# EAGLE board ECU_JUMPER (EAGLE 9.1.3), part 1 of 2
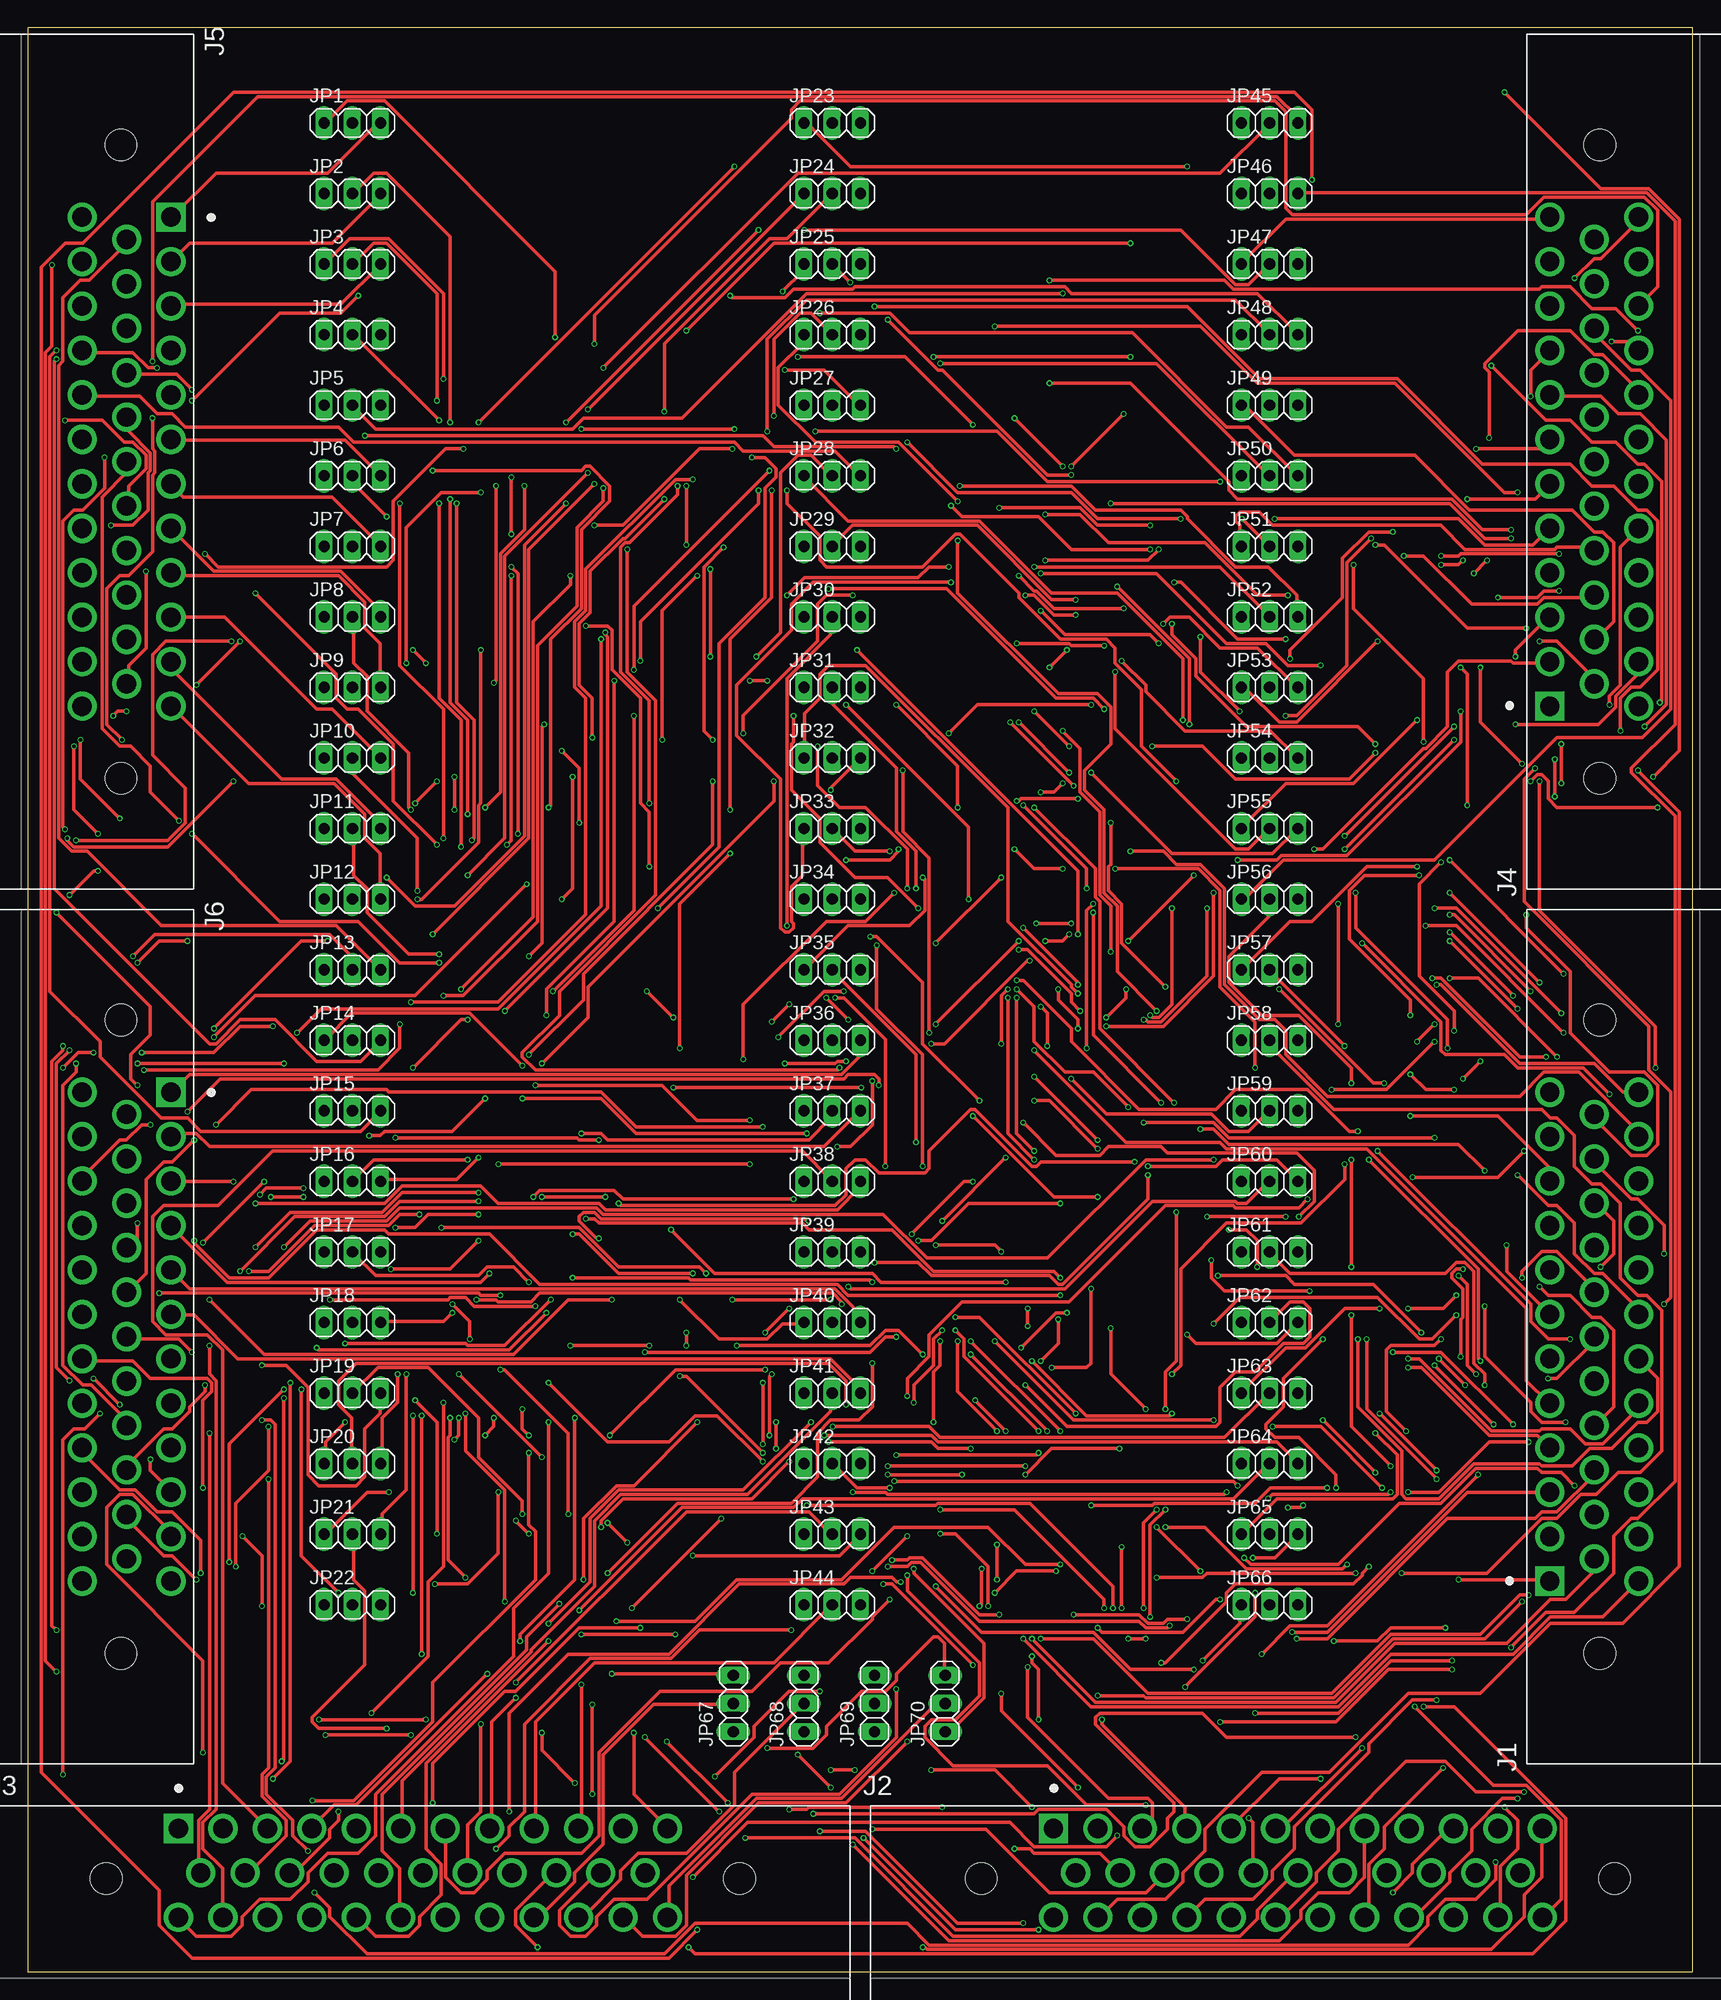
[diagram p2: board, top side]
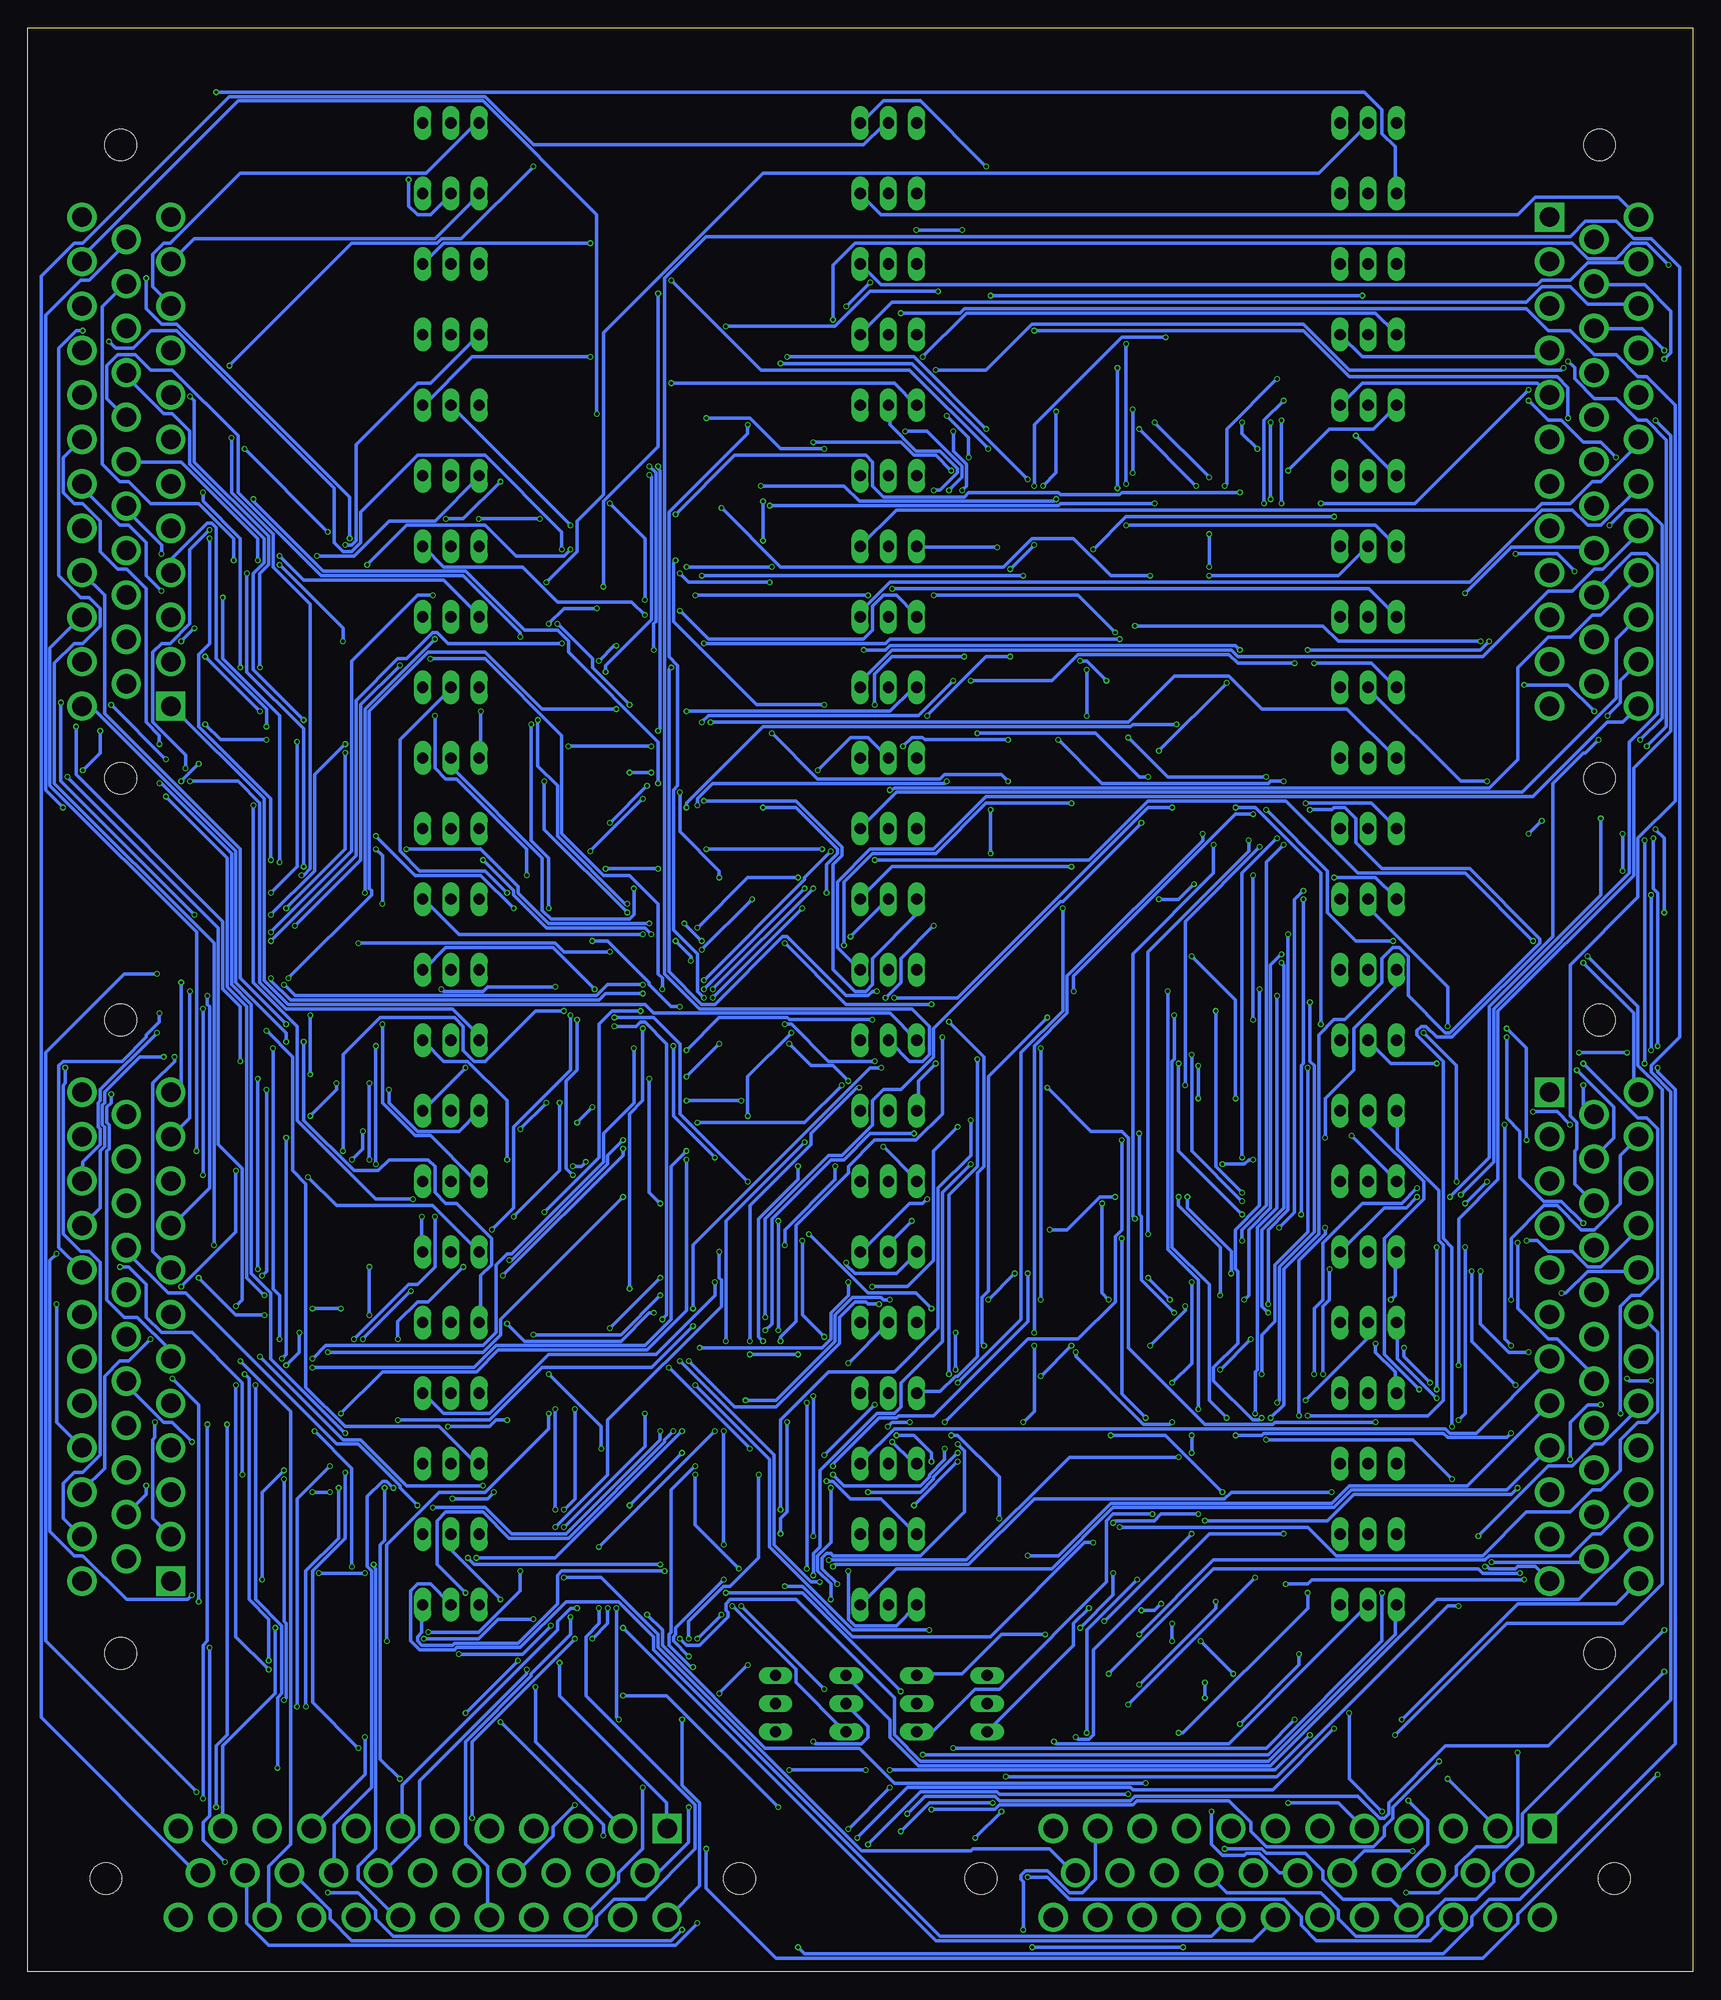
[diagram p3: board, bottom side, seen from below]

Size 149.84 x 174.93 mm. Coordinates in mm from the lower left corner, seen from the top.
Outline: 0,0 149.84,0 149.84,174.93 0,174.93 0,0
Copper layers (1*16): Top 0.035mm / dielectric 1.5mm / Bottom 0.035mm
Design rules "default *": minimum track width 12mil, minimum drill 0.3mm, track to track 3.5mil, track to pad 6mil, pad to pad 6mil, via to via 6mil, smd to smd 6mil, copper to edge 40mil, drill to drill 6mil, minimum pad ring 4mil, minimum via ring 4mil, stop-mask expansion 4mil, vias tented up to drill 0mil, thermal gap 10mil

## Footprints (pad centres in the part's own frame; a part is rotated, then mirrored left to right if it is on the bottom)
TE_776180-1 = drill 1.75 square: 1 -22,4 | drill 1.75: 2 -18,4; 3 -14,4; 4 -10,4; 5 -6,4; 6 -2,4; 7 2,4; 8 6,4; 9 10,4; 10 14,4; 11 18,4; 12 22,4; 13 -20,0; 14 -16,0; 15 -12,0; 16 -8,0; 17 -4,0; 18 0,0; 19 4,0; 20 8,0; 21 12,0; 22 16,0; 23 20,0; 24 -22,-4; 25 -18,-4; 26 -14,-4; 27 -10,-4; 28 -6,-4; 29 -2,-4; 30 2,-4; 31 6,-4; 32 10,-4; 33 14,-4; 34 18,-4; 35 22,-4 | hole 2.85: -28.5,-0.5; 28.5,-0.5
1X03 = drill 1.016 long: 1 -2.54,0; 2 0,0; 3 2.54,0

## Placement (x,y rotation side)
J1  776180-1  [TE_776180-1]  140.97,57.15 90 top
J2  776180-1  [TE_776180-1]  114.3,8.89 0 top
J3  776180-1  [TE_776180-1]  35.56,8.89 0 top
J4  776180-1  [TE_776180-1]  140.97,135.89 90 top
J5  776180-1  [TE_776180-1]  8.89,135.89 270 top
J6  776180-1  [TE_776180-1]  8.89,57.15 270 top
JP1  [1X03]  29.21,166.37 0 top
JP2  [1X03]  29.21,160.02 0 top
JP3  [1X03]  29.21,153.67 0 top
JP4  [1X03]  29.21,147.32 0 top
JP5  [1X03]  29.21,140.97 0 top
JP6  [1X03]  29.21,134.62 0 top
JP7  [1X03]  29.21,128.27 0 top
JP8  [1X03]  29.21,121.92 0 top
JP9  [1X03]  29.21,115.57 0 top
JP10  [1X03]  29.21,109.22 0 top
JP11  [1X03]  29.21,102.87 0 top
JP12  [1X03]  29.21,96.52 0 top
JP13  [1X03]  29.21,90.17 0 top
JP14  [1X03]  29.21,83.82 0 top
JP15  [1X03]  29.21,77.47 0 top
JP16  [1X03]  29.21,71.12 0 top
JP17  [1X03]  29.21,64.77 0 top
JP18  [1X03]  29.21,58.42 0 top
JP19  [1X03]  29.21,52.07 0 top
JP20  [1X03]  29.21,45.72 0 top
JP21  [1X03]  29.21,39.37 0 top
JP22  [1X03]  29.21,33.02 0 top
JP23  [1X03]  72.39,166.37 0 top
JP24  [1X03]  72.39,160.02 0 top
JP25  [1X03]  72.39,153.67 0 top
JP26  [1X03]  72.39,147.32 0 top
JP27  [1X03]  72.39,140.97 0 top
JP28  [1X03]  72.39,134.62 0 top
JP29  [1X03]  72.39,128.27 0 top
JP30  [1X03]  72.39,121.92 0 top
JP31  [1X03]  72.39,115.57 0 top
JP32  [1X03]  72.39,109.22 0 top
JP33  [1X03]  72.39,102.87 0 top
JP34  [1X03]  72.39,96.52 0 top
JP35  [1X03]  72.39,90.17 0 top
JP36  [1X03]  72.39,83.82 0 top
JP37  [1X03]  72.39,77.47 0 top
JP38  [1X03]  72.39,71.12 0 top
JP39  [1X03]  72.39,64.77 0 top
JP40  [1X03]  72.39,58.42 0 top
JP41  [1X03]  72.39,52.07 0 top
JP42  [1X03]  72.39,45.72 0 top
JP43  [1X03]  72.39,39.37 0 top
JP44  [1X03]  72.39,33.02 0 top
JP45  [1X03]  111.76,166.37 0 top
JP46  [1X03]  111.76,160.02 0 top
JP47  [1X03]  111.76,153.67 0 top
JP48  [1X03]  111.76,147.32 0 top
JP49  [1X03]  111.76,140.97 0 top
JP50  [1X03]  111.76,134.62 0 top
JP51  [1X03]  111.76,128.27 0 top
JP52  [1X03]  111.76,121.92 0 top
JP53  [1X03]  111.76,115.57 0 top
JP54  [1X03]  111.76,109.22 0 top
JP55  [1X03]  111.76,102.87 0 top
JP56  [1X03]  111.76,96.52 0 top
JP57  [1X03]  111.76,90.17 0 top
JP58  [1X03]  111.76,83.82 0 top
JP59  [1X03]  111.76,77.47 0 top
JP60  [1X03]  111.76,71.12 0 top
JP61  [1X03]  111.76,64.77 0 top
JP62  [1X03]  111.76,58.42 0 top
JP63  [1X03]  111.76,52.07 0 top
JP64  [1X03]  111.76,45.72 0 top
JP65  [1X03]  111.76,39.37 0 top
JP66  [1X03]  111.76,33.02 0 top
JP67  [1X03]  63.5,24.13 90 top
JP68  [1X03]  69.85,24.13 90 top
JP69  [1X03]  76.2,24.13 90 top
JP70  [1X03]  82.55,24.13 90 top

## Tracks (layer width: path | path; a pad name or v marks a point on that pad's centre or on a via)
1  (via drill 0.3)
  Top 0.305: v103.16,125.04 103.75,125.04 108.87,119.92 v113.2,119.92 | v119.5,97.09 119.5,93.94 127.77,85.67 v127.77,83.11 | v127.18,56.93 126.59,56.34 122.65,56.34 122.26,55.94 122.26,50.43 v124.03,48.66 | v120.68,36.45 120.09,35.87 120.09,35.67 119.3,34.88 108.67,34.88 107.89,34.09 107.89,33.31 102.38,27.79 v101.98,27.79
  Bottom 0.305: v103.16,125.04 100.41,127.79 100.41,130.55 98.04,132.91 98.04,147.48 83.67,161.85 33.67,161.85 29.34,166.18 JP1.2 | v113.2,119.92 119.5,113.62 v119.5,97.09 | v127.77,83.11 127.77,61.45 127.18,60.86 v127.18,56.93 | v124.03,48.66 120.68,45.31 v120.68,36.45 | v101.98,27.79 101.98,24.84 92.34,15.2 92.34,13.03 J2.1
1_1  (via drill 0.3)
  Top 0.305: v47.45,147.09 47.45,152.99 32.1,168.34 28.75,168.34 26.78,166.38 JP1.1 | v59.27,128.38 v59.27,133.7 | v61.43,118.34 v61.43,126.22 | v68.91,113.03 68.91,110.67 68.71,110.47 68.71,106.34 71.27,103.78 71.27,101.61 74.42,98.46 77.38,98.46 v80.13,95.71 | v88.2,87.64 88.2,75.43 v90.56,73.07 | v126.78,45.12 v121.67,50.23 | v128.75,35.27 136.82,35.27 J1.1
  Bottom 0.305: v47.45,147.09 51.39,147.09 59.27,139.21 v59.27,133.7 | v61.43,126.22 v59.27,128.38 | v61.43,118.34 63.59,118.34 v68.91,113.03 | v88.2,87.64 v80.13,95.71 | v90.56,73.07 90.56,59.49 94.11,55.94 107.49,55.94 109.46,53.97 117.93,53.97 v121.67,50.23 | v126.78,45.12 128.75,43.15 v128.75,35.27
1_2
  Top 0.305: JP1.3 31.71,166.18 31.31,166.18 26.98,161.85 16.94,161.85 13,157.91 J5.1
2  (via drill 0.3)
  Top 0.305: v38,139.41 38,156.14 32.3,161.85 31.11,161.85 29.34,160.08 JP2.2 | v38,132.52 38,114.21 39.58,112.64 v39.58,104.17 | v58.08,85.87 v55.72,88.23 | v63.79,56.34 75.8,56.34 77.18,57.72 78.36,57.72 v80.52,55.55 | v91.75,48.66 v84.85,55.55 | v110.45,34.09 110.45,31.93 v104.15,25.63
  Bottom 0.305: v38,132.52 v38,139.41 | v39.58,104.17 41.15,104.17 55.72,89.6 v55.72,88.23 | v58.08,85.87 63.4,80.55 63.4,61.26 63.99,60.67 63.99,56.53 v63.79,56.34 | v84.85,55.55 v80.52,55.55 | v91.75,48.66 92.53,47.87 92.53,47.68 101.19,39.01 106.51,39.01 108.87,41.38 112.22,41.38 113,40.59 113,36.65 v110.45,34.09 | v104.15,25.63 104.15,20.71 96.47,13.03 J2.2
2_1  (via drill 0.3)
  Top 0.305: v132.89,169.13 141.55,160.47 145.88,160.47 148.63,157.72 148.63,109.88 v146.27,107.52 | v131.12,59.88 131.12,55.35 135.25,51.22 135.25,50.43 136.23,49.45 v138.4,49.45
  Bottom 0.305: v132.89,169.13 29.54,169.13 27.96,167.56 27.96,165.39 26.78,164.21 26.78,160.08 JP2.1 | v146.27,107.52 132.69,93.94 132.69,74.45 130.52,72.28 130.52,60.47 v131.12,59.88 | v138.4,49.45 138.4,48.07 138.59,47.87 138.59,40.79 137.02,39.21 J1.2
2_2
  Top 0.305: JP2.3 31.71,159.88 27.38,155.55 14.58,155.55 13,153.97 J5.2
3  (via drill 0.3)
  Top 0.305: v36.82,141.38 36.82,151.02 32.3,155.55 31.11,155.55 29.34,153.78 JP3.2 | v38.59,132.12 38.59,114.21 40.17,112.64 40.17,102.01 v39.97,101.81 | v49.03,66.38 49.62,66.38 53.16,62.83 v59.85,62.83 | v89.78,45.51 v77.38,45.51 | v89.97,27.4 89.97,22.87 97.26,15.59 100.8,15.59 101.19,15.2 101.19,13.82 100.41,13.03 J2.3
  Bottom 0.305: v36.82,141.38 38.59,139.6 v38.59,132.12 | v39.97,101.81 39.97,100.82 49.03,91.77 v49.03,66.38 | v59.85,62.83 59.85,58.5 68.32,50.04 71.47,50.04 71.67,49.84 73.24,49.84 77.38,45.71 v77.38,45.51 | v89.78,45.51 91.94,43.34 91.94,30.55 92.14,30.35 92.14,29.37 90.17,27.4 v89.97,27.4
3_1  (via drill 0.3)
  Top 0.305: v37.41,143.34 37.41,151.02 32.49,155.94 28.95,155.94 26.78,153.78 JP3.1 | v42.14,133.7 42.14,116.18 v41.94,115.98 | v48.04,109.88 49.62,108.31 v49.62,103.38 | v83.48,58.9 85.64,58.9 v94.3,50.23 | v105.52,36.06 v101.59,40 | v113.79,30.55 116.94,30.55 129.54,43.15 136.82,43.15 J1.3
  Bottom 0.305: v37.41,143.34 41.94,138.82 41.94,133.9 v42.14,133.7 | v48.04,109.88 v41.94,115.98 | v49.62,103.38 56.71,96.3 56.9,96.3 68.32,84.88 68.32,82.32 71.27,79.37 72.85,79.37 73.83,78.38 73.83,76.22 76.59,73.46 77.77,73.46 83.48,67.75 v83.48,58.9 | v94.3,50.23 94.3,47.28 v101.59,40 | v105.52,36.06 105.52,34.29 109.26,30.55 v113.79,30.55
3_2
  Top 0.305: JP3.3 31.71,153.58 28.16,150.04 13,150.04 J5.3
4  (via drill 0.3)
  Top 0.305: v37.02,139.6 29.34,147.28 JP4.2 | v37.02,132.12 37.02,114.6 38.99,112.64 v38.99,101.22 | v45.68,79.76 57.1,79.76 60.25,76.61 v64.97,76.61 | v82.1,41.57 88.79,41.57 96.86,33.5 v96.86,32.71 | v96.67,22.68 96.67,22.28 104.15,14.8 104.15,13.03 J2.4
  Bottom 0.305: v37.02,132.12 v37.02,139.6 | v38.99,101.22 45.68,94.53 v45.68,79.76 | v64.97,76.61 64.97,73.46 67.93,70.51 67.93,57.91 71.86,53.97 77.77,53.97 82.1,49.64 v82.1,41.57 | v96.86,32.71 96.86,22.87 v96.67,22.68
4_1  (via drill 0.3)
  Top 0.305: v69.3,145.31 78.95,145.31 v85.05,139.21 | v88.99,87.64 88.99,75.43 v90.56,73.86 | v124.22,54.37 125.41,54.37 131.51,48.27 135.84,48.27 136.82,47.28 J1.4
  Bottom 0.305: v69.3,145.31 65.37,149.25 28.56,149.25 26.78,147.48 JP4.1 | v85.05,139.21 85.05,138.42 92.14,131.34 92.14,118.34 91.35,117.56 91.35,106.73 91.75,106.34 91.75,93.74 89.58,91.57 89.58,88.23 v88.99,87.64 | v90.56,73.86 91.94,72.48 91.94,58.7 94.3,56.34 107.69,56.34 109.66,54.37 v124.22,54.37
4_2
  Bottom 0.305: JP4.3 31.71,147.28 29.74,145.31 13.4,145.31 13,145.71 J5.4
5  (via drill 0.3)
  Top 0.305: v93.12,151.02 70.09,151.02 58.87,139.8 50.01,139.8 49.03,138.82 31.31,138.82 29.34,140.79 JP5.2 | v98.04,124.64 104.54,118.15 v104.54,112.24 | v102.97,95.71 102.97,87.05 101.78,85.87 101.19,85.87 v101,86.06 | v108.08,66.77 109.66,66.77 110.64,65.79 v110.64,63.42 | v116.55,56.93 113,53.38 113,50.83 111.43,49.25 111.43,48.86 112.22,48.07 114.38,48.07 117.73,44.72 v117.73,43.54 | v116.35,17.36 112.61,17.36 108.28,13.03 J2.5
  Bottom 0.305: v93.12,151.02 93.12,137.24 98.04,132.32 v98.04,124.64 | v104.54,112.24 104.54,101.81 102.97,100.23 v102.97,95.71 | v101,86.06 101,81.14 106.12,76.02 106.12,68.74 v108.08,66.77 | v110.64,63.42 113.79,60.27 114.78,60.27 116.55,58.5 v116.55,56.93 | v117.73,43.54 117.73,38.82 118.12,38.42 118.12,19.13 v116.35,17.36
5_1  (via drill 0.3)
  Top 0.305: v36.43,135.08 49.82,135.08 50.21,135.47 50.6,135.47 52.38,133.7 52.38,132.32 49.82,129.76 49.82,122.68 47.06,119.92 47.06,104.96 v46.86,104.76 | v73.83,85.67 v71.86,87.64 | v90.56,82.91 98.83,74.64 107.3,74.64 107.89,74.05 120.49,74.05 134.85,59.68 134.85,53.19 136.82,51.22 J1.5
  Bottom 0.305: v36.43,135.08 32.69,138.82 28.75,138.82 26.78,140.79 JP5.1 | v46.86,104.76 49.03,104.76 66.15,87.64 v71.86,87.64 | v73.83,85.67 81.31,85.67 81.51,85.87 87.61,85.87 v90.56,82.91
5_2
  Bottom 0.305: JP5.3 31.71,140.98 29.74,142.95 13.99,142.95 13,141.97 J5.5
6  (via drill 0.3)
  Top 0.305: v32.3,130.94 29.34,133.9 29.34,134.49 JP6.2 | v53.95,127.99 53.95,116.97 56.51,114.41 56.51,96.89 47.85,88.23 47.85,86.06 44.5,82.72 44.5,82.32 45.68,81.14 72.85,81.14 v73.04,81.34 | v89.97,58.11 v89.97,59.68 | v121.27,44.92 v116.55,49.64 | v120.09,20.12 113,13.03 112.41,13.03 J2.6
  Bottom 0.305: v32.3,130.94 51,130.94 v53.95,127.99 | v73.04,81.34 74.03,81.34 89.97,65.39 v89.97,59.68 | v89.97,58.11 93.71,54.37 103.56,54.37 108.28,49.64 v116.55,49.64 | v121.27,44.92 121.27,39.01 124.22,36.06 124.22,24.25 v120.09,20.12
6_1  (via drill 0.3)
  Top 0.305: v30.33,138.23 66.15,138.23 67.14,137.24 77.97,137.24 v78.16,137.05 | v93.12,135.47 v88.79,139.8 | v93.12,111.65 94.7,110.08 94.7,106.14 96.47,104.37 96.47,96.89 97.45,95.9 v97.45,91.77 | v120.09,92.56 127.18,85.47 127.18,82.91 127.57,82.52 132.89,82.52 134.07,81.34 139.97,81.34 v142.34,78.97
  Bottom 0.305: v30.33,138.23 26.78,134.68 JP6.1 | v78.16,137.05 82.1,137.05 84.85,139.8 v88.79,139.8 | v93.12,135.47 93.12,135.27 92.93,135.08 92.93,111.85 v93.12,111.65 | v97.45,91.77 101.59,91.77 102.38,92.56 v120.09,92.56 | v142.34,78.97 142.34,78.19 142.73,77.79 142.73,76.42 142.53,76.22 142.53,74.05 142.73,73.86 142.73,60.47 141.15,58.9 139.97,58.9 137.02,55.94 137.02,55.16 J1.6
6_2
  Top 0.305: JP6.3 31.71,134.68 28.56,137.83 13,137.83 J5.6
7  (via drill 0.3)
  Top 0.305: v43.52,125.63 43.52,101.81 v43.12,101.42 | v50.21,67.75 51,67.75 51.39,67.36 69.7,67.36 70.29,66.77 77.77,66.77 81.51,63.03 92.34,63.03 v92.93,62.44 | v97.45,57.91 97.45,53.78 v100.6,50.63 | v101.59,41.57 100.41,40.39 v100.41,32.71
  Bottom 0.305: v43.52,125.63 31.9,125.63 29.34,128.19 JP7.2 | v43.12,101.42 43.12,98.86 50.41,91.57 50.41,67.95 v50.21,67.75 | v97.45,57.91 v92.93,62.44 | v100.6,50.63 100.6,42.56 v101.59,41.57 | v100.41,32.71 101,32.71 102.18,31.53 102.18,30.75 116.15,16.77 116.15,13.03 J2.7
7_1  (via drill 0.3)
  Top 0.305: v51,130.16 53.56,130.16 60.45,137.05 v63.4,137.05 | v91.94,152.2 107.69,152.2 108.48,151.42 136.04,151.42 136.23,151.61 138.79,151.61 140.76,149.64 142.93,149.64 v144.89,147.68 | v133.08,65.39 133.08,63.03 136.82,59.29 J1.7
  Bottom 0.305: JP7.1 28.56,130.16 v51,130.16 | v63.4,137.05 70.48,144.13 83.87,144.13 v91.94,152.2 | v144.89,147.68 145.49,147.68 147.06,146.1 147.06,125.63 145.09,123.66 144.3,123.66 143.32,122.68 143.32,121.1 144.89,119.53 145.68,119.53 147.45,117.75 147.45,106.93 133.08,92.56 v133.08,65.39
7_2
  Top 0.305: JP7.3 31.71,128.38 27.38,132.72 13.99,132.72 13,133.7 J5.7
8  (via drill 0.3)
  Top 0.305: v34.46,104.56 34.27,104.76 34.27,109.68 30.52,113.42 30.52,116.57 29.34,117.75 29.34,121.89 JP8.2 | v38,49.84 38,48.27 37.81,48.07 37.81,37.05 v39.38,35.47 | v50.8,15.98 v50.8,24.05 | v74.22,11.45 82.89,2.79 112.61,2.79 114.58,4.76 114.58,5.55 116.15,7.12 118.91,7.12 120.29,8.5 120.29,12.83 J2.8
  Bottom 0.305: v34.46,104.56 32.49,104.56 32.3,104.76 31.31,104.76 30.33,103.78 30.33,101.61 27.96,99.25 20.09,99.25 13.79,92.95 13.79,92.56 21.86,84.49 22.26,84.49 25.6,87.83 25.6,91.38 26.39,92.16 26.98,92.16 27.96,91.18 27.96,89.01 31.31,85.67 32.3,85.67 33.67,84.29 33.67,66.38 36.82,63.23 36.82,51.02 v38,49.84 | v50.8,24.05 v39.38,35.47 | v50.8,15.98 62.41,15.98 62.61,16.18 69.5,16.18 v74.22,11.45
8_1  (via drill 0.3)
  Top 0.305: v72.06,124.45 82.69,124.45 92.53,114.6 95.88,114.6 v96.86,113.62 | v126.39,89.41 127.18,89.41 134.26,82.32 v136.63,82.32
  Bottom 0.305: v72.06,124.45 29.15,124.45 26.78,122.09 JP8.1 | v96.86,113.62 103.56,113.62 108.67,118.74 113.79,118.74 119.11,113.42 119.11,97.48 118.91,97.28 118.91,96.89 v126.39,89.41 | v136.63,82.32 136.63,81.93 138.59,79.96 138.59,64.8 137.02,63.23 J1.8
8_2
  Top 0.305: JP8.3 31.71,122.09 31.71,122.48 28.16,126.02 16.75,126.02 13,129.76 J5.8
9  (via drill 0.3)
  Top 0.305: v18.52,107.12 12.61,101.22 4.15,101.22 3.56,101.81 v3.56,102.01 | v3.16,83.31 3.16,82.91 2.18,81.93 2.18,31.14 v2.57,30.75 | v70.68,14.21 90.56,14.21 90.96,14.61 97.06,14.61 98.63,13.03 98.63,12.24 99.62,11.26 101,11.26 102.57,12.83 102.57,13.82 103.16,14.41 103.16,15.2 96.07,22.28 96.07,22.87 96.47,23.27 105.72,23.27 107.89,21.1 v119.5,21.1
  Bottom 0.305: v18.52,107.12 20.88,107.12 29.15,115.39 JP9.2 | v3.56,102.01 3.56,97.48 3.16,97.09 v3.16,83.31 | v2.57,30.75 13,20.31 22.26,20.31 27.38,15.2 27.38,14.21 27.77,13.82 28.16,13.82 30.13,15.79 50.21,15.79 50.6,15.39 62.41,15.39 62.81,15.79 69.11,15.79 v70.68,14.21 | v119.5,21.1 119.5,17.75 124.22,13.03 J2.9
9_1  (via drill 0.3)
  Top 0.305: v34.07,117.75 34.07,129.96 37.22,133.11 v40.76,133.11 | v91.55,131.14 94.7,131.14 97.26,128.58 105.92,128.58 110.64,123.86 v113.4,123.86 | v133.67,87.83 v127.97,93.54
  Bottom 0.305: v34.07,117.75 28.95,117.75 26.78,115.59 JP9.1 | v40.76,133.11 51.39,133.11 51.59,132.91 56.9,132.91 57.1,133.11 65.17,133.11 65.56,132.72 72.85,132.72 73.83,133.7 73.83,135.87 74.42,136.46 86.23,136.46 v91.55,131.14 | v113.4,123.86 114.78,123.86 120.68,117.95 120.68,100.82 v127.97,93.54 | v133.67,87.83 133.67,87.05 133.48,86.85 133.48,70.51 136.82,67.16 J1.9
9_2
  Top 0.305: JP9.3 31.71,115.59 31.71,119.53 30.33,120.9 30.33,123.27 27.96,125.63 13.2,125.63 13,125.82 J5.9
10  (via drill 0.3)
  Top 0.305: v35.05,97.28 35.05,102.01 29.34,107.72 29.34,109.09 JP10.2 | v37.22,66.97 49.62,66.97 53.16,63.42 60.45,63.42 v61.04,62.83 | v72.26,60.47 v63.4,60.47 | v88,48.66 v85.25,51.42 | v98.44,32.71 v98.44,38.23 | v122.85,7.12 124.62,8.9 124.62,9.68 127.77,12.83 128.16,12.83 J2.10
  Bottom 0.305: v35.05,97.28 35.84,96.5 35.84,68.34 v37.22,66.97 | v63.4,60.47 v61.04,62.83 | v72.26,60.47 72.85,60.47 73.04,60.67 75.6,60.67 77.18,59.09 77.18,56.73 82.49,51.42 v85.25,51.42 | v98.44,38.23 v88,48.66 | v98.44,32.71 98.44,31.34 99.62,30.16 99.62,24.84 89.78,15 89.78,11.06 94.3,6.53 97.06,6.53 98.63,4.96 98.63,4.17 99.62,3.19 116.94,3.19 118.52,4.76 118.52,5.55 120.09,7.12 v122.85,7.12
10_1  (via drill 0.3)
  Top 0.305: v94.11,106.73 v88.4,112.44 | v97.45,103.38 97.45,99.64 97.26,99.45 97.26,97.28 98.44,96.1 98.44,92.56 v102.38,88.62 | v112.61,88.42 121.07,79.96 v122.06,79.96 | v124.42,77.01 132.3,77.01 136.82,72.48 136.82,71.3 J1.10
  Bottom 0.305: v88.4,112.44 50.8,112.44 46.67,116.57 41.75,116.57 38.79,113.62 31.11,113.62 26.78,109.29 JP10.1 | v97.45,103.38 v94.11,106.73 | v102.38,88.62 108.48,88.62 108.87,88.23 112.41,88.23 v112.61,88.42 | v122.06,79.96 122.06,79.37 v124.42,77.01
10_2
  Top 0.305: JP10.3 31.71,109.29 27.38,113.62 26,113.62 17.73,121.89 13,121.89 J5.10
11  (via drill 0.3)
  Top 0.305: v37.02,91.57 34.27,91.57 30.52,95.31 30.52,97.48 29.34,98.66 29.34,102.79 JP11.2 | v40.37,60.47 42.14,60.47 42.34,60.27 45.29,60.27 46.08,61.06 72.45,61.06 73.24,60.27 v73.24,60.08 | v90.37,54.96 95.29,50.04 102.77,50.04 v102.97,50.23 | v117.53,29.76 121.47,29.76 122.65,30.94 v127.57,30.94
  Bottom 0.305: v37.02,91.57 38,90.59 38,68.74 39.97,66.77 39.97,60.86 v40.37,60.47 | v73.24,60.08 74.22,60.08 74.42,60.27 75.41,60.27 76.78,58.9 76.78,56.53 82.49,50.83 86.23,50.83 v90.37,54.96 | v102.97,50.23 102.97,48.86 108.67,43.15 112.81,43.15 117.53,38.42 v117.53,29.76 | v127.57,30.94 127.57,25.04 132.3,20.31 132.3,13.03 J2.11
11_1  (via drill 0.3)
  Top 0.305: v36.82,107.12 v34.86,105.16 | v57.1,110.87 57.1,122.48 v60.25,125.63 | v89.19,125.63 90.56,124.25 90.76,124.25 92.34,122.68 v98.63,122.68 | v102.97,121.3 102.97,120.31 105.13,118.15 105.13,116.57 109.66,112.05 119.7,112.05 v121.27,110.47 | v127.97,95.12 128.36,95.12 v135.25,88.23
  Bottom 0.305: v34.86,105.16 28.95,105.16 26.78,102.99 JP11.1 | v36.82,107.12 38,107.12 38.2,106.93 53.16,106.93 v57.1,110.87 | v89.19,125.63 v60.25,125.63 | v98.63,122.68 101.59,122.68 v102.97,121.3 | v121.27,110.47 124.03,107.72 124.03,99.05 v127.97,95.12 | v135.25,88.23 135.25,76.81 136.82,75.23 J1.11
11_2
  Top 0.305: JP11.3 31.71,102.99 31.71,103.38 27.77,107.32 22.85,107.32 13,117.16 13,117.75 J5.11
12  (via drill 0.3)
  Top 0.305: v22.06,85.08 19.11,85.08 16.75,82.72 v10.25,82.72 | v5.92,82.72 4.54,82.72 v3.16,81.34 | v80.52,2.2 80.72,2.2 80.92,2.01 131.71,2.01 134.66,4.96 134.66,6.93 136.23,8.5 136.23,12.83 J2.12
  Bottom 0.305: v22.06,85.08 22.06,88.62 29.15,95.71 29.15,96.5 JP12.2 | v5.92,82.72 v10.25,82.72 | v3.16,81.34 3.16,80.94 1.59,79.37 1.59,20.51 15.56,6.53 18.32,6.53 19.89,4.96 19.89,4.17 22.45,1.61 79.93,1.61 v80.52,2.2
12_1  (via drill 0.3)
  Top 0.305: v32.3,98.46 34.86,95.9 38.4,95.9 44.7,102.2 44.7,128.38 v48.44,132.12 | v83.08,131.93 84.07,130.94 90.96,130.94 93.91,127.99 v101,127.99 | v119.3,126.61 119.3,122.68 125.6,116.38 v125.6,110.67 | v136.04,89.01 v127.97,97.09
  Bottom 0.305: v32.3,98.46 28.56,98.46 26.78,96.69 JP12.1 | v48.44,132.12 56.9,132.12 57.1,131.93 v83.08,131.93 | v101,127.99 101.59,127.4 105.92,127.4 108.67,130.16 115.76,130.16 v119.3,126.61 | v125.6,110.67 125.6,99.45 v127.97,97.09 | v136.04,89.01 136.04,79.96 136.82,79.17 J1.12
12_2
  Top 0.305: JP12.3 31.71,96.69 31.71,100.63 30.33,102.01 30.33,104.17 27.57,106.93 19.89,106.93 13,113.82 J5.12
13  (via drill 0.3)
  Top 0.305: v9.46,91.38 11.43,93.34 27.18,93.34 29.15,91.38 29.15,90.19 JP13.2 | v34.46,21.3 v26.78,21.3 | v74.42,18.15 v72.26,18.15 | v81.31,18.15 87.02,18.15 v90.37,14.8
  Bottom 0.305: v9.46,91.38 4.93,86.85 4.93,81.53 2.77,79.37 2.77,34.88 6.31,31.34 16.75,31.34 v26.78,21.3 | v34.46,21.3 37.61,18.15 v72.26,18.15 | v81.31,18.15 v74.42,18.15 | v90.37,14.8 90.37,11.65 93.12,8.9 94.11,8.9 J2.13
13_1  (via drill 0.3)
  Top 0.305: v33.08,75.04 49.42,75.04 49.62,74.84 v51.39,74.84 | v67.34,47.09 v67.34,49.45 | v84.07,44.72 v77.38,44.72 | v90.37,29.96 96.07,24.25 117.73,24.25 123.04,29.57 133.08,29.57 137.02,33.5 138.4,33.5 140.96,36.06 140.96,37.05 J1.13
  Bottom 0.305: v33.08,75.04 33.08,78.58 30.52,81.14 30.52,84.88 26.78,88.62 26.78,90 JP13.1 | v51.39,74.84 51.39,66.77 51.98,66.18 51.98,60.27 55.33,56.93 59.85,56.93 v67.34,49.45 | v67.34,47.09 67.34,46.1 68.71,44.72 68.71,44.53 69.5,43.74 76.39,43.74 v77.38,44.72 | v84.07,44.72 84.07,37.24 86.63,34.68 87.22,34.68 90.37,31.53 v90.37,29.96
13_2
  Top 0.305: JP13.3 31.71,90.19 27.77,94.13 12.02,94.13 5.33,100.82 3.95,100.82 2.77,102.01 2.77,144.53 3.16,144.92 3.16,150.63 4.74,152.2 5.52,152.2 9.07,155.75 J5.13
14  (via drill 0.3)
  Top 0.305: v9.86,81.73 v23.04,81.73 | v6.51,50.23 5.13,48.86 4.15,48.86 3.16,47.87 v3.16,17.75 | v88.79,11.06 90.17,11.06 90.56,10.67 96.47,10.67 98.24,8.9 J2.14
  Bottom 0.305: v23.04,81.73 27.18,81.73 29.15,83.7 JP14.2 | v9.86,81.73 4.93,76.81 4.15,76.81 3.16,75.82 3.16,62.44 4.74,60.86 5.52,60.86 6.51,59.88 v6.51,50.23 | v3.16,17.75 15.76,5.16 15.76,4.37 18.91,1.22 82.49,1.22 88.79,7.52 v88.79,11.06
14_1  (via drill 0.3)
  Top 0.305: v44.5,81.53 39.78,86.26 29.15,86.26 26.78,83.9 JP14.1 | v44.5,78.58 51.59,78.58 54.74,75.43 v70.09,75.43 | v83.48,57.72 84.26,56.93 84.26,55.35 v90.96,48.66 | v109.46,37.24 110.05,36.65 117.93,36.65 123.44,42.16 127.18,42.16 130.33,45.31 135.84,45.31 136.23,44.92 138,44.92 v139.19,43.74
  Bottom 0.305: v44.5,78.58 v44.5,81.53 | v70.09,75.43 74.03,75.43 76.39,73.07 77.57,73.07 82.89,67.75 82.89,58.31 v83.48,57.72 | v90.96,48.66 102.38,37.24 v109.46,37.24 | v139.19,43.74 139.19,42.95 140.96,41.18 J1.14
14_2  (via drill 0.3)
  Top 0.305: v2.57,145.12 2.38,144.92 2.38,97.48 16.35,83.5 16.94,83.5 19.11,85.67 22.26,85.67 26,81.93 29.93,81.93 31.71,83.7 JP14.3
  Bottom 0.305: v2.57,145.12 1.98,145.71 1.98,149.45 4.34,151.81 8.87,151.81 J5.14
15  (via drill 0.3)
  Top 0.305: v24.62,52.4 24.62,37.44 v27.96,34.09 | v72.26,16.57 v69.3,19.53 | v76,12.83 86.23,12.83 91.94,7.12 100.6,7.12 102.18,8.7 J2.15
  Bottom 0.305: v24.62,52.4 27.77,55.55 27.77,65.98 24.23,69.53 24.23,71.1 29.15,76.02 29.15,77.4 JP15.2 | v27.96,34.09 27.96,29.76 38.2,19.53 v69.3,19.53 | v76,12.83 v72.26,16.57
15_1  (via drill 0.3)
  Top 0.305: v34.66,34.09 v34.66,50.04 | v46.27,21.49 46.27,19.92 v49.23,16.97 | v94.11,32.12 100.01,32.12 100.8,31.34 102.18,31.34 102.57,31.73 v104.34,31.73 | v114.19,29.96 116.94,29.96 127.77,40.79 135.64,40.79 136.23,41.38 137.61,41.38 140.96,44.72 140.96,45.12 J1.15
  Bottom 0.305: v34.66,50.04 23.83,50.04 22.45,51.42 22.45,65.39 22.85,65.79 22.85,70.31 26.59,74.05 26.59,77.4 JP15.1 | v34.66,34.09 34.66,32.71 45.88,21.49 v46.27,21.49 | v49.23,16.97 71.86,16.97 75.01,20.12 83.48,20.12 92.73,29.37 92.73,30.75 v94.11,32.12 | v104.34,31.73 107.49,31.73 109.26,29.96 v114.19,29.96
15_2  (via drill 0.3)
  Top 0.305: v2.57,145.9 1.98,145.31 1.98,88.23 6.51,83.7 6.51,82.32 12.02,76.81 14.38,76.81 15.56,75.63 29.93,75.63 31.71,77.4 JP15.3
  Bottom 0.305: v2.57,145.9 4.54,147.87 8.87,147.87 J5.15
16  (via drill 0.3)
  Top 0.305: v39.58,73.07 31.11,73.07 29.34,71.3 JP16.2 | v64.97,72.68 v42.34,72.68 | v79.15,35.67 79.15,34.29 85.64,27.79 85.64,24.84 83.48,22.68 81.31,22.68 80.72,22.09 80.72,21.1 83.28,18.54 91.75,18.54 95.29,15 v100.6,15
  Bottom 0.305: v39.58,73.07 39.97,73.07 40.37,72.68 v42.34,72.68 | v64.97,72.68 67.53,70.12 67.53,56.73 71.27,52.99 71.27,50.83 71.86,50.23 73.44,50.23 78.56,45.12 78.56,38.23 79.15,37.64 v79.15,35.67 | v100.6,15 102.57,13.03 102.57,12.24 106.12,8.7 J2.16
16_1  (via drill 0.3)
  Top 0.305: v30.72,75.23 31.71,75.23 32.1,75.63 38.2,75.63 v41.15,78.58 | v45.09,91.38 46.27,92.56 46.27,112.05 v46.47,112.24 | v90.56,104.76 96.07,99.25 96.07,96.69 96.47,96.3 96.47,84.88 v103.16,78.19 | v105.52,75.82 106.71,75.82 108.08,74.45 128.75,74.45 v131.12,72.09 | v136.04,61.65 136.82,60.86 138.79,60.86 140.76,58.9 141.55,58.9 142.73,57.72 142.73,50.83 141.15,49.25 J1.16
  Bottom 0.305: v30.72,75.23 26.78,71.3 JP16.1 | v41.15,78.58 41.15,87.44 v45.09,91.38 | v46.47,112.24 50.41,112.24 50.6,112.05 83.67,112.05 90.56,105.16 v90.56,104.76 | v105.52,75.82 v103.16,78.19 | v131.12,72.09 131.12,66.57 v136.04,61.65
16_2  (via drill 0.3)
  Top 0.305: v40.56,73.27 38.59,71.3 31.9,71.3 JP16.3 | v37.41,102.01 37.41,113.62 33.48,117.56 v33.48,132.12 | v14.78,142.36 13.4,143.74 9.07,143.74 J5.16
  Bottom 0.305: v40.56,73.27 40.56,98.86 v37.41,102.01 | v33.48,132.12 25.01,132.12 v14.78,142.36
17  (via drill 0.3)
  Top 0.305: v45.09,62.05 43.71,63.42 41.35,63.42 40.56,62.64 31.31,62.64 29.34,64.61 JP17.2 | v46.86,52.99 52.18,47.68 57.69,47.68 60.05,50.04 62.02,50.04 v66.15,45.9 | v70.09,41.97 81.71,41.97 81.9,42.16 90.17,42.16 97.65,34.68 v97.65,32.71 | v100.6,29.96 v99.03,29.96 | v109.85,13.82 110.25,13.42 110.25,8.9 J2.17
  Bottom 0.305: v45.09,62.05 45.09,54.76 v46.86,52.99 | v70.09,41.97 v66.15,45.9 | v97.65,32.71 97.65,31.34 v99.03,29.96 | v100.6,29.96 109.85,20.71 v109.85,13.82
17_1  (via drill 0.3)
  Top 0.305: v27.18,60.47 37.81,60.47 38,60.67 39.38,60.67 40.17,59.88 v45.68,59.88 | v55.92,56.34 v48.83,56.34 | v58.67,53.58 59.27,53.58 v66.15,46.69 | v74.22,43.15 77.18,43.15 77.38,42.95 107.69,42.95 v107.89,43.15 | v111.63,42.56 112.02,42.95 122.45,42.95 v122.65,43.15 | v124.22,43.15 126.98,43.15 131.51,47.68 v135.05,47.68
  Bottom 0.305: v27.18,60.47 26.78,60.86 26.78,64.61 JP17.1 | v45.68,59.88 45.68,59.49 v48.83,56.34 | v58.67,53.58 v55.92,56.34 | v66.15,46.69 68.32,44.53 68.32,44.33 69.5,43.15 v74.22,43.15 | v107.89,43.15 108.48,42.56 v111.63,42.56 | v124.22,43.15 v122.65,43.15 | v135.05,47.68 136.82,49.45 137.61,49.45 141.15,52.99 J1.17
17_2  (via drill 0.3)
  Top 0.305: v21.86,69.72 v24.82,69.72 | v8.28,103.78 4.74,107.32 v4.74,110.87 | v7.49,130.16 9.46,130.16 10.84,131.53 10.84,134.88 11.04,135.08 11.04,136.65 9.07,138.62 9.07,139.8 J5.17
  Bottom 0.305: v24.82,69.72 25.8,68.74 27.77,68.74 31.71,64.8 JP17.3 | v21.86,69.72 18.32,73.27 18.32,86.85 8.28,96.89 v8.28,103.78 | v4.74,110.87 2.77,112.83 2.77,130.16 4.15,131.53 6.11,131.53 v7.49,130.16
18  (via drill 0.3)
  Top 0.305: v34.86,51.42 36.82,49.45 v36.82,39.41 | v62.22,14.41 v55.52,21.1 | v64.58,12.05 74.42,12.05 83.28,3.19 109.07,3.19 110.64,4.76 110.64,5.55 113.79,8.7 114.19,8.7 J2.18
  Bottom 0.305: v34.86,51.42 29.34,56.93 29.34,58.31 JP18.2 | v36.82,39.41 43.52,39.41 53.95,28.97 53.95,21.3 54.34,20.9 55.33,20.9 v55.52,21.1 | v64.58,12.05 v62.22,14.41
18_1  (via drill 0.3)
  Top 0.305: v23.04,51.61 23.04,19.13 v22.85,18.94 | v68.52,14.61 70.09,14.61 70.29,14.8 v82.3,14.8 | v96.27,24.84 100.41,24.84 100.6,24.64 117.53,24.64 122.85,29.96 131.12,29.96 v134.46,33.31 | v136.82,53.38 137.61,53.38 140.96,56.73 140.96,57.12 J1.18
  Bottom 0.305: v23.04,51.61 26.59,55.16 26.59,58.31 JP18.1 | v22.85,18.94 26.98,14.8 26.98,13.82 27.77,13.03 27.77,12.24 28.75,11.26 38.4,11.26 39.78,12.64 39.78,13.42 41.75,15.39 50.01,15.39 50.41,15 62.41,15 62.81,14.61 v68.52,14.61 | v82.3,14.8 92.34,24.84 v96.27,24.84 | v134.46,33.31 134.46,51.02 v136.82,53.38
18_2  (via drill 0.3)
  Top 0.305: v38.2,59.29 37.41,58.5 31.9,58.5 JP18.3 | v37.02,90.79 33.48,90.79 29.74,94.53 22.65,94.53 v14.78,102.4 | v13.59,103.58 11.04,106.14 11.04,108.5 9.27,110.27 8.28,110.27 6.71,111.85 6.71,132.72 8.87,134.88 8.87,135.87 J5.18
  Bottom 0.305: v38.2,59.29 38.79,59.88 38.79,66.77 36.82,68.74 36.82,90.59 v37.02,90.79 | v13.59,103.58 v14.78,102.4
19  (via drill 0.3)
  Top 0.305: JP19.2 31.51,54.37 36.04,54.37 40.56,49.84 40.56,46.3 44.5,42.36 v44.5,41.18 | v53.95,38.62 v52.18,40.39 | v81.71,34.68 85.84,30.55 95.88,30.55 99.22,27.2 v104.93,27.2
  Bottom 0.305: v44.5,41.18 47.85,41.18 48.44,40.59 51.98,40.59 v52.18,40.39 | v53.95,38.62 54.74,38.62 63.2,30.16 75.6,30.16 80.13,34.68 v81.71,34.68 | v104.93,27.2 104.93,26.81 114.58,17.16 114.58,12.24 118.12,8.7 J2.19
19_1  (via drill 0.3)
  Top 0.305: v28.56,56.53 39.38,56.53 39.58,56.34 42.93,56.34 v47.06,60.47 | v49.03,62.44 59.46,62.44 59.66,62.24 75.8,62.24 v76,62.05 | v89.38,56.14 92.53,59.29 v93.52,59.29 | v106.71,58.31 109.07,60.67 121.47,60.67 125.21,56.93 126.39,56.93 v128.56,59.09 | v134.46,62.44 134.46,63.03 136.23,64.8 137.61,64.8 141.15,61.26 J1.19
  Bottom 0.305: v28.56,56.53 28.56,55.75 26.78,53.97 26.78,52.2 JP19.1 | v49.03,62.44 v47.06,60.47 | v76,62.05 76,60.86 77.57,59.29 77.57,56.93 78.36,56.14 v89.38,56.14 | v93.52,59.29 93.91,59.29 96.47,56.73 105.13,56.73 v106.71,58.31 | v128.56,59.09 131.12,59.09 v134.46,62.44
19_2  (via drill 0.3)
  Top 0.305: v21.08,54.57 23.24,54.57 25.21,52.6 25.21,44.72 26.19,43.74 29.54,43.74 30.33,44.53 30.33,48.86 31.71,50.23 31.71,52.01 JP19.3 | v3.36,139.6 6.71,139.6 8.67,137.64 9.46,137.64 10.64,136.46 10.64,135.27 9.07,133.7 9.07,131.93 J5.19
  Bottom 0.305: v21.08,54.57 21.08,67.75 17.53,71.3 17.53,86.45 5.33,98.66 5.33,108.31 1.98,111.65 1.98,138.23 v3.36,139.6
20  (via drill 0.3)
  Top 0.305: v73.63,51.02 73.63,53.19 72.06,54.76 29.54,54.76 27.96,53.19 27.96,51.02 29.15,49.84 29.15,45.9 JP20.2 | v78.16,46.49 90.76,46.49 v90.96,46.69 | v95.68,41.97 101.19,41.97 101.39,42.16 110.45,42.16 111.82,43.54 v116.94,43.54
  Bottom 0.305: v78.16,46.49 v73.63,51.02 | v95.68,41.97 v90.96,46.69 | v116.94,43.54 117.53,44.13 117.93,44.13 119.3,42.75 119.3,36.45 118.91,36.06 118.91,16.57 122.26,13.23 122.26,8.9 J2.20
20_1  (via drill 0.3)
  Top 0.305: v28.56,49.45 26.78,47.68 26.78,45.9 JP20.1 | v75.01,79.57 v58.08,79.57 | v92.93,48.66 v84.85,56.73 | v113.4,41.77 114.58,41.77 v114.78,41.97
  Bottom 0.305: v28.56,49.45 37.61,49.45 37.81,49.25 43.91,49.25 50.8,56.14 50.8,75.04 51.39,75.63 54.15,75.63 v58.08,79.57 | v75.01,79.57 75.21,79.57 79.34,75.43 79.34,74.45 84.85,68.94 v84.85,56.73 | v92.93,48.66 92.93,47.87 101.39,39.41 106.31,39.41 108.67,41.77 v113.4,41.77 | v114.78,41.97 116.35,43.54 116.35,43.74 120.09,47.48 122.06,47.48 135.64,61.06 137.22,61.06 141.15,65 J1.20
20_2  (via drill 0.3)
  Top 0.305: v33.28,53.78 33.28,51.22 31.9,49.84 31.9,45.9 JP20.3 | v32.69,63.23 38,63.23 v40.56,65.79 | v36.82,101.42 32.89,105.35 32.89,110.47 29.74,113.62 28.75,113.62 27.77,114.6 27.77,116.77 v20.48,124.05
  Bottom 0.305: v33.28,53.78 33.28,59.88 32.69,60.47 v32.69,63.23 | v40.56,65.79 40.56,66.77 38.4,68.94 38.4,99.84 v36.82,101.42 | v20.48,124.05 16.35,128.19 9.27,128.19 9.07,127.99 J5.20
21  (via drill 0.3)
  Top 0.305: v32.3,21.89 26.19,21.89 25.6,22.48 25.6,22.87 30.33,27.6 30.33,34.29 29.34,35.27 29.34,39.21 JP21.2 | v75.21,12.05 83.48,3.78 v90.96,3.78
  Bottom 0.305: v32.3,21.89 37.81,16.38 50.41,16.38 50.6,16.57 70.68,16.57 v75.21,12.05 | v90.96,3.78 91.94,2.79 120.68,2.79 122.65,4.76 122.65,5.55 125.8,8.7 126.19,8.7 J2.21
21_1  (via drill 0.3)
  Top 0.305: v32.49,43.15 30.52,43.15 26.78,39.41 JP21.1 | v77.38,36.45 79.15,36.45 79.54,36.85 80.33,36.85 85.64,31.53 100.01,31.53 100.6,30.94 102.57,30.94 v102.77,31.14 | v111.04,28.58 113.59,31.14 116.94,31.14 v130.52,44.72 | v141.55,63.42 142.73,64.61 142.73,67.56 141.15,69.13 J1.21
  Bottom 0.305: v32.49,43.15 41.55,43.15 42.14,42.56 59.27,42.56 65.17,36.65 77.18,36.65 v77.38,36.45 | v102.77,31.14 105.33,28.58 v111.04,28.58 | v130.52,44.72 130.52,52.99 135.05,57.52 137.81,57.52 139.19,58.9 139.19,61.85 140.76,63.42 v141.55,63.42
21_2  (via drill 0.3)
  Top 0.305: v34.07,53.78 34.07,43.34 31.9,41.18 31.9,39.41 JP21.3 | v24.82,70.51 21.47,70.51 v20.88,69.92
  Bottom 0.305: v34.07,53.78 34.07,59.68 33.28,60.47 33.28,65.59 29.74,69.13 26.19,69.13 v24.82,70.51 | v20.88,69.92 17.93,72.87 17.93,86.65 5.72,98.86 5.72,110.67 3.16,113.23 3.16,126.61 4.15,127.6 5.52,127.6 9.07,124.05 J5.21
22  (via drill 0.3)
  Top 0.305: v63.01,15.2 v57.49,20.71 | v71.27,12.64 75.41,12.64 83.67,4.37 v89.58,4.37
  Bottom 0.305: v57.49,20.71 57.3,20.51 41.75,20.51 29.34,32.91 JP22.2 | v63.01,15.2 68.71,15.2 v71.27,12.64 | v89.58,4.37 91.55,2.4 128.16,2.4 130.13,4.37 130.13,8.7 J2.22
22_1  (via drill 0.3)
  Top 0.305: v91.15,29.96 95.88,29.96 100.8,25.04 117.34,25.04 122.65,30.35 130.72,30.35 134.26,33.9 v135.05,33.9 | v147.26,64.61 147.26,67.16 144.89,69.53 144.3,69.53 141.15,72.68 141.15,73.07 J1.22
  Bottom 0.305: v91.15,29.96 90.56,29.37 89.38,29.37 86.82,31.93 86.82,32.32 87.02,32.52 87.02,33.11 86.63,33.5 80.72,33.5 71.86,24.64 71.86,21.3 69.5,18.94 38.2,18.94 26.78,30.35 26.78,32.91 JP22.1 | v135.05,33.9 135.45,33.5 140.96,33.5 144.89,37.44 145.68,37.44 147.85,39.6 147.85,64.01 v147.26,64.61
23
  Bottom 0.305: JP23.2 72.45,166.18 72.85,166.18 74.62,164.41 104.34,164.41 108.67,168.74 131.71,168.74 144.89,155.55 145.68,155.55 148.63,152.6 148.63,22.87 134.46,8.7 J2.23
23_1  (via drill 0.3)
  Top 0.305: v104.34,162.44 74.03,162.44 70.29,166.18 69.89,166.18 JP23.1 | v131.71,144.53 136.63,139.6 138.79,139.6 140.76,137.64 142.93,137.64 144.89,135.67 145.49,135.67 147.06,134.09 147.06,114.41 v146.86,114.21 | v134.85,95.12 134.85,93.94 138.79,90 138.79,84.49 142.34,80.94 145.49,80.94 146.67,79.76 146.67,74.45 145.68,73.46 144.3,73.46 141.15,76.61 141.15,77.01 J1.23
  Bottom 0.305: v104.34,162.44 110.84,155.94 112.61,155.94 113,155.55 120.68,155.55 v131.71,144.53 | v146.86,114.21 146.86,107.12 v134.85,95.12
23_2  (via drill 0.3)
  Top 0.305: v40.56,139.41 v63.59,162.44 | v39.19,137.05 37.61,137.05 32.89,132.32 32.89,127.01 32.3,126.42 17.14,126.42 v15.96,127.6 | v10.64,126.02 10.64,119.13 9.07,117.56 9.07,115.98 J5.23
  Bottom 0.305: v63.59,162.44 69.5,168.34 72.85,168.34 74.82,166.38 JP23.3 | v40.56,139.41 40.56,138.42 v39.19,137.05 | v15.96,127.6 12.22,127.6 v10.64,126.02
24  (via drill 0.3)
  Top 0.305: v57.3,140.39 57.3,146.49 66.75,155.94 68.32,155.94 72.26,159.88 JP24.2 | v58.48,133.7 58.48,132.91 54.15,128.58 53.75,128.58 53.36,128.19 53.36,116.97 55.92,114.41 v55.92,105.16 | v76.39,92.36 76.39,86.65 80.52,82.52 v80.52,72.48 | v83.67,56.73 83.67,52.2 v87.22,48.66 | v87.22,35.27 v87.22,38.42 | v90.37,28.38 90.37,27.79 90.96,27.2 v90.96,22.68
  Bottom 0.305: v57.3,140.39 57.3,134.88 v58.48,133.7 | v55.92,105.16 63.59,105.16 68.12,100.63 73.83,100.63 76.39,98.07 v76.39,92.36 | v80.52,72.48 80.52,71.3 84.07,67.75 84.07,57.12 v83.67,56.73 | v87.22,38.42 v87.22,48.66 | v87.22,35.27 91.55,30.94 91.55,30.35 91.75,30.16 91.75,29.76 v90.37,28.38 | v90.96,22.68 90.96,16.77 89.38,15.2 89.38,7.71 92.14,4.96 J2.24
24_1  (via drill 0.3)
  Top 0.305: v50.41,140.59 69.7,159.88 JP24.1 | v50.41,134.88 42.93,127.4 42.93,102.01 v39.58,98.66 | v39.58,85.67 38.99,85.67 v34.66,81.34 | v46.27,46.3 v38.79,53.78 | v77.77,37.05 79.15,37.05 79.34,37.24 80.52,37.24 85.64,32.12 v87.41,32.12 | v89.58,29.96 95.68,23.86 117.93,23.86 122.65,28.58 133.67,28.58 137.02,31.93 141.75,31.93 144.89,35.08 J1.24
  Bottom 0.305: v50.41,134.88 v50.41,140.59 | v39.58,85.67 v39.58,98.66 | v34.66,81.34 34.66,66.57 37.61,63.62 37.61,58.5 38.79,57.32 v38.79,53.78 | v46.27,46.3 56.12,46.3 65.37,37.05 v77.77,37.05 | v89.58,29.96 v87.41,32.12
24_2
  Bottom 0.305: JP24.3 74.82,159.88 73.04,158.11 15.76,158.11 14.19,159.68 6.71,159.68 4.93,157.91 J5.24
25  (via drill 0.3)
  Top 0.305: v74.03,152.01 72.45,153.58 JP25.2 | v76.19,149.84 104.34,149.84 110.84,143.34 123.24,143.34 130.92,135.67 138.79,135.67 140.76,133.7 142.73,133.7 144.89,131.53 145.68,131.53 146.67,130.55 146.67,117.16 145.09,115.59 144.3,115.59 143.32,114.6 v143.32,111.65 | v144.89,108.11 148.63,104.37 148.63,36.45 143.52,31.34 137.02,31.34 130.72,25.04 124.22,25.04 117.14,17.95 111.04,17.95 105.92,12.83 105.92,10.86 103.95,8.9 103.95,8.11 102.38,6.53 98.04,6.53 96.47,4.96 J2.25
  Bottom 0.305: v76.19,149.84 v74.03,152.01 | v143.32,111.65 143.32,109.68 v144.89,108.11
25_1  (via drill 0.3)
  Top 0.305: v67.93,151.22 69.7,152.99 69.7,153.58 JP25.1 | v87.02,148.07 105.52,148.07 110.64,142.95 123.04,142.95 132.89,133.11 v134.07,133.11 | v130.72,117.36 130.72,112.44 v134.46,108.7 | v136.04,107.12 136.04,95.51 146.47,85.08 v146.47,81.34
  Bottom 0.305: v67.93,151.22 74.03,151.22 77.18,148.07 v87.02,148.07 | v134.07,133.11 134.07,132.32 130.72,128.97 v130.72,117.36 | v136.04,107.12 v134.46,108.7 | v146.47,81.34 146.47,79.96 146.67,79.76 146.67,66.38 145.09,64.8 144.3,64.8 143.32,63.82 143.32,46.49 144.89,44.92 145.68,44.92 146.67,43.94 146.67,40.79 145.09,39.21 J1.25
25_2
  Bottom 0.305: JP25.3 74.82,153.58 73.04,151.81 13.99,151.81 13.59,152.2 11.04,152.2 9.46,153.78 4.93,153.78 J5.25
26  (via drill 0.3)
  Top 0.305: v67.14,140 67.14,146.89 69.5,149.25 70.48,149.25 72.26,147.48 JP26.2 | v65.17,136.26 66.35,136.26 67.34,135.27 67.34,134.49 66.35,133.5 66.35,123.66 62.22,119.53 62.22,101.22 v56.71,95.71 | v66.15,47.48 v66.15,52.99 | v76.98,34.88 77.77,34.88 v85.05,27.6 | v87.61,25.04 87.61,23.46 v94.5,16.57
  Bottom 0.305: v67.14,140 65.17,138.03 v65.17,136.26 | v56.71,95.71 56.71,86.45 60.45,82.72 60.45,58.7 v66.15,52.99 | v66.15,47.48 65.56,46.89 65.56,41.38 69.5,37.44 77.38,37.44 77.57,37.64 77.97,37.64 78.36,37.24 78.36,36.26 v76.98,34.88 | v87.61,25.04 v85.05,27.6 | v94.5,16.57 94.5,11.06 96.67,8.9 96.67,8.11 99.82,4.96 100.21,4.96 J2.26
26_1  (via drill 0.3)
  Top 0.305: v83.67,132.32 78.36,137.64 70.88,137.64 67.53,140.98 67.53,144.33 69.7,146.49 69.7,147.28 JP26.1 | v83.67,128.78 83.67,124.05 92.73,115 96.27,115 97.45,113.82 97.45,110.47 95.09,108.11 95.09,106.34 96.86,104.56 96.86,97.09 98.04,95.9 98.04,90 v101.59,86.45 | v121.47,73.86 135.25,60.08 135.25,58.5 136.82,56.93 v138.79,56.93
  Bottom 0.305: v83.67,128.78 v83.67,132.32 | v101.59,86.45 104.15,86.45 108.67,81.93 109.66,81.93 110.64,82.91 110.64,85.08 111.43,85.87 118.12,85.87 121.47,82.52 v121.47,73.86 | v138.79,56.93 140.76,54.96 141.55,54.96 142.93,53.58 142.93,45.31 144.89,43.34 J1.26
26_2
  Bottom 0.305: JP26.3 74.82,147.48 72.06,150.23 14.97,150.23 13.59,151.61 11.04,151.61 9.46,150.04 4.93,150.04 J5.26
27  (via drill 0.3)
  Top 0.305: v68.32,133.31 68.32,132.12 71.27,129.17 71.27,127.01 71.86,126.42 80.52,126.42 83.48,129.37 83.87,129.37 89.19,124.05 89.19,123.66 92.93,119.92 97.06,119.92 97.85,119.13 97.85,117.75 100.21,115.39 100.21,110.27 v103.36,107.12 | v95.88,95.31 95.88,84.29 v101.98,78.19 | v113.2,67.95 v106.12,67.95 | v120.49,56.93 120.49,50.63 v126.78,44.33 | v126.78,24.45 124.62,24.45 120.68,20.51 120.68,19.72 113.99,13.03 113.99,11.06 112.02,9.09 112.02,8.31 110.25,6.53 105.92,6.53 104.34,4.96 J2.27
  Bottom 0.305: v68.32,133.31 67.73,133.31 66.15,134.88 66.15,135.27 67.73,136.85 69.89,136.85 72.26,139.21 72.26,140.79 JP27.2 | v103.36,107.12 103.36,102.79 v95.88,95.31 | v101.98,78.19 101.98,72.09 v106.12,67.95 | v113.2,67.95 113.2,63.42 114.78,61.85 115.56,61.85 v120.49,56.93 | v126.78,44.33 126.78,31.53 126.59,31.34 126.59,24.64 v126.78,24.45
27_1  (via drill 0.3)
  Top 0.305: v91.94,142.95 99.22,142.95 108.08,134.09 108.08,133.31 108.87,132.52 128.16,132.52 130.92,129.76 v133.48,129.76 | v135.64,108.31 134.66,107.32 134.66,96.3 145.88,85.08 145.88,81.14 147.85,79.17 147.85,60.67 v147.26,60.08
  Bottom 0.305: v91.94,142.95 71.86,142.95 69.89,140.98 JP27.1 | v133.48,129.76 135.25,127.99 135.25,121.3 137.02,119.53 137.81,119.53 138.59,118.74 138.59,112.44 135.64,109.49 v135.64,108.31 | v147.26,60.08 147.26,49.45 145.09,47.28 J1.27
27_2  (via drill 0.3)
  Top 0.305: v68.12,144.13 71.67,144.13 74.82,140.98 JP27.3 | v11.63,144.33 10.84,144.33 9.46,145.71 4.93,145.71 J5.27
  Bottom 0.305: v68.12,144.13 63.59,144.13 59.46,148.27 35.05,148.27 30.92,144.13 11.82,144.13 v11.63,144.33
28  (via drill 0.3)
  Top 0.305: v65.56,118.34 67.73,120.51 67.73,134.88 69.3,136.46 70.48,136.46 72.26,134.68 JP28.2 | v73.63,114.01 84.66,102.99 v84.66,96.5 | v89.19,91.97 89.97,91.97 93.91,88.03 93.91,87.24 v94.7,86.45 | v103.36,68.34 103.36,54.96 102.38,53.97 v102.38,50.63 | v102.38,41.57 101,40.2 v101,31.93
  Bottom 0.305: v65.56,118.34 72.06,118.34 73.63,116.77 v73.63,114.01 | v89.19,91.97 v84.66,96.5 | v94.7,86.45 97.26,86.45 98.44,85.27 98.44,73.27 v103.36,68.34 | v102.38,41.57 v102.38,50.63 | v101,31.93 101,30.35 104.54,26.81 104.54,26.61 110.45,20.71 110.45,11.45 108.48,9.49 108.48,4.96 J2.28
28_1  (via drill 0.3)
  Top 0.305: v103.95,112.64 103.95,118.15 98.04,124.05 92.14,124.05 85.64,130.55 73.83,130.55 69.89,134.49 JP28.1 | v95.88,96.1 95.29,95.51 v95.29,83.11 | v124.22,55.16 125.21,55.16 131.71,48.66 136.04,48.66 136.23,48.86 138.79,48.86 140.17,47.48 141.75,47.48 144.89,50.63 144.89,51.02 J1.28
  Bottom 0.305: v103.95,112.64 103.95,108.5 102.18,106.73 102.18,102.2 96.07,96.1 v95.88,96.1 | v95.29,83.11 95.29,78.19 98.04,75.43 98.04,72.87 106.31,64.61 106.71,64.61 107.69,63.62 107.69,57.52 108.87,56.34 123.04,56.34 v124.22,55.16
28_2
  Top 0.305: JP28.3 74.82,134.68 72.65,136.85 64.38,136.85 63.59,137.64 29.34,137.64 27.96,139.01 14.19,139.01 13,140.19 11.63,140.19 10.05,141.77 4.93,141.77 J5.28
29  (via drill 0.3)
  Top 0.305: v94.3,123.46 92.14,123.46 85.45,130.16 74.22,130.16 72.45,128.38 JP29.2 | v97.45,132.12 127.97,132.12 131.12,128.97 v133.48,128.97 | v138.2,89.8 v127.97,100.04 | v134.66,16.18 130.33,16.18 127.57,18.94 124.03,18.94 117.93,12.83 117.93,10.86 115.96,8.9 115.96,8.11 112.81,4.96 112.41,4.96 J2.29
  Bottom 0.305: v94.3,123.46 94.3,128.97 v97.45,132.12 | v133.48,128.97 133.48,119.53 134.46,118.54 134.46,112.05 127.97,105.55 v127.97,100.04 | v138.2,89.8 141.15,89.8 148.24,82.72 148.24,29.76 v134.66,16.18
29_1  (via drill 0.3)
  Top 0.305: v62.61,128.19 60.84,126.42 60.84,111.65 v61.63,110.87 | v71.08,110.27 71.08,106.73 73.04,104.76 75.41,104.76 79.15,101.02 v79.15,97.48 | v88.2,88.42 87.61,87.83 v87.61,83.5 | v96.27,74.84 v90.56,80.55 | v106.51,64.01 106.51,62.44 107.69,61.26 v115.37,61.26 | v119.7,56.93 119.7,50.83 123.63,46.89 123.63,42.95 124.03,42.56 126.98,42.56 130.13,45.71 136.04,45.71 136.23,45.51 138.99,45.51 140.56,47.09 142.53,47.09 144.89,49.45 145.68,49.45 146.67,50.43 146.67,53.38 145.09,54.96 J1.29
  Bottom 0.305: v62.61,128.19 69.7,128.19 JP29.1 | v61.63,110.87 69.11,110.87 69.3,111.06 70.29,111.06 v71.08,110.27 | v88.2,88.42 v79.15,97.48 | v90.56,80.55 v87.61,83.5 | v96.27,74.84 97.65,73.46 97.65,72.68 106.31,64.01 v106.51,64.01 | v119.7,56.93 v115.37,61.26
29_2
  Bottom 0.305: JP29.3 71.67,131.53 14.19,131.53 13.59,132.12 11.04,132.12 9.07,134.09 8.28,134.09 4.93,137.44 4.93,137.83 J5.29
30  (via drill 0.3)
  Top 0.305: v68.32,94.13 68.32,116.38 72.26,120.31 72.26,121.89 JP30.2 | v72.65,87.64 73.44,87.64 77.18,83.9 v77.18,72.48 | v81.71,65.39 87.02,65.39 v87.61,64.8 | v102.38,40 105.92,40 109.66,36.26 118.32,36.26 v118.71,36.65
  Bottom 0.305: v68.32,94.13 71.27,91.18 71.27,89.01 v72.65,87.64 | v77.18,72.48 77.18,71.3 81.71,66.77 v81.71,65.39 | v87.61,64.8 87.61,62.44 87.41,62.24 87.41,59.88 97.65,49.64 97.65,44.72 v102.38,40 | v118.71,36.65 118.71,36.45 118.52,36.26 118.52,11.06 120.09,9.49 120.09,8.31 116.75,4.96 116.35,4.96 J2.30
30_1  (via drill 0.3)
  Top 0.305: v91.15,122.48 93.32,120.31 101,120.31 v101.78,119.53 | v134.07,86.65 v127.97,92.75 | v134.07,71.69 136.82,68.94 137.61,68.94 139.19,67.36 139.19,64.61 140.96,62.83 141.75,62.83 144.89,59.68 144.89,59.29 J1.30
  Bottom 0.305: v91.15,122.48 88.59,119.92 74.62,119.92 73.83,120.71 73.83,122.87 72.85,123.86 71.67,123.86 69.89,122.09 JP30.1 | v101.78,119.53 112.02,119.53 113,120.51 113.4,120.51 115.76,118.15 116.55,118.15 120.29,114.41 120.29,100.43 v127.97,92.75 | v134.07,71.69 v134.07,86.65
30_2
  Bottom 0.305: JP30.3 74.82,122.09 74.82,122.48 72.26,125.04 20.09,125.04 13.59,131.53 10.84,131.53 9.46,130.16 8.28,130.16 4.74,133.7 J5.30
31  (via drill 0.3)
  Top 0.305: v79.93,97.48 79.93,100.82 78.16,102.6 78.16,108.31 72.45,114.01 72.45,115.39 JP31.2 | v88.99,88.42 90.56,86.85 90.56,83.7 93.32,80.94 95.88,80.94 v99.03,77.79 | v100.41,76.42 106.71,76.42 108.08,75.04 v126.59,75.04 | v129.34,52.79 v126.98,55.16 | v127.38,18.34 122.06,13.03 122.06,11.06 120.68,9.68 120.68,5.16 120.49,4.96 J2.31
  Bottom 0.305: v88.99,88.42 v79.93,97.48 | v100.41,76.42 v99.03,77.79 | v126.59,75.04 126.59,55.55 v126.98,55.16 | v129.34,52.79 129.34,33.5 126.98,31.14 126.98,25.04 127.38,24.64 v127.38,18.34
31_1  (via drill 0.3)
  Top 0.305: v93.71,110.27 v90.56,113.42 | v101.19,110.27 105.72,110.27 108.67,107.32 118.91,107.32 v121.27,109.68 | v126.59,95.71 128.56,95.71 v138,86.26
  Bottom 0.305: v90.56,113.42 72.26,113.42 70.29,115.39 69.89,115.39 JP31.1 | v101.19,110.27 v93.71,110.27 | v121.27,109.68 121.27,101.02 v126.59,95.71 | v138,86.26 138,85.47 139.19,84.29 139.19,84.09 141.35,81.93 146.67,81.93 147.06,81.53 147.06,65.19 145.09,63.23 J1.31
31_2
  Bottom 0.305: JP31.3 74.82,115.59 74.82,116.18 72.06,118.94 41.55,118.94 40.96,118.34 18.91,118.34 13,124.25 10.84,124.25 8.87,126.22 8.08,126.22 4.93,129.37 4.93,129.76 J5.31
32  (via drill 0.3)
  Top 0.305: v78.75,108.11 78.75,102.6 81.12,100.23 v81.12,84.49 | v85.05,77.01 92.34,69.72 v96.27,69.72 | v122.85,55.75 127.18,55.75 v133.67,49.25 | v134.07,15.59 132.69,15.59 129.93,12.83 129.93,10.86 127.97,8.9 127.97,8.11 124.82,4.96 124.42,4.96 J2.32
  Bottom 0.305: v78.75,108.11 75.8,111.06 74.22,111.06 72.45,109.29 JP32.2 | v81.12,84.49 85.05,80.55 v85.05,77.01 | v96.27,69.72 107.3,58.7 107.3,57.32 108.87,55.75 v122.85,55.75 | v133.67,49.25 133.67,29.76 134.07,29.37 v134.07,15.59
32_1  (via drill 0.3)
  Top 0.305: v94.5,88.03 93.91,88.62 93.91,88.82 88.2,94.53 88.2,104.76 75.41,117.56 72.06,117.56 71.27,116.77 71.27,114.6 69.89,113.23 69.89,109.29 JP32.1 | v127.97,89.41 130.52,89.41 v137.61,82.32
  Bottom 0.305: v94.5,88.03 97.85,88.03 98.44,87.44 126.19,87.44 127.97,89.21 v127.97,89.41 | v137.61,82.32 139.78,82.32 142.93,79.17 142.93,78.19 143.12,77.99 143.12,76.22 142.93,76.02 142.93,74.25 143.32,73.86 143.32,68.74 144.89,67.16 J1.32
32_2  (via drill 0.3)
  Top 0.305: v72.26,106.34 72.26,106.53 74.82,109.09 JP32.3
  Bottom 0.305: v72.26,106.34 72.06,106.34 71.86,106.53 18.32,106.53 15.76,109.09 15.76,117.36 13,120.12 11.04,120.12 9.07,122.09 8.28,122.09 4.93,125.43 4.93,125.82 J5.32
33  (via drill 0.3)
  Top 0.305: v77.57,100.82 74.42,100.82 72.45,102.79 JP33.2 | v88.99,89.21 89.58,89.21 93.91,84.88 93.91,83.7 100.01,77.6 106.9,77.6 108.67,79.37 115.17,79.37 118.91,75.63 v119.7,75.63 | v120.68,73.07 130.52,63.23 130.52,55.16 v130.72,54.96
  Bottom 0.305: v77.57,100.82 79.93,98.46 79.93,98.27 v88.99,89.21 | v119.7,75.63 119.7,74.05 v120.68,73.07 | v130.72,54.96 126.19,50.43 126.19,11.45 128.16,9.49 128.16,4.96 J2.33
33_1  (via drill 0.3)
  Top 0.305: v83.08,125.04 70.68,125.04 68.71,123.07 68.71,120.71 63.79,115.79 63.79,111.26 67.73,107.32 67.73,93.94 68.12,93.54 68.52,93.54 68.91,93.94 68.91,94.33 68.71,94.53 68.71,97.68 69.7,98.66 69.7,102.79 JP33.1 | v91.15,125.82 101.59,125.82 107.89,119.53 111.43,119.53 113.4,117.56 v116.35,117.56 | v125.8,94.13 128.56,94.13 v138.2,84.49
  Bottom 0.305: v83.08,125.04 90.37,125.04 v91.15,125.82 | v116.35,117.56 119.89,114.01 119.89,100.04 v125.8,94.13 | v138.2,84.49 143.32,79.37 143.32,78.38 143.52,78.19 143.52,76.02 143.32,75.82 143.32,74.45 144.89,72.87 144.89,71.3 J1.33
33_2
  Bottom 0.305: JP33.3 74.82,102.99 71.67,106.14 15.37,106.14 6.9,114.6 6.9,119.92 4.93,121.89 J5.33
34  (via drill 0.3)
  Top 0.305: v75.8,93.15 76.39,93.15 80.52,89.01 80.52,83.5 v85.64,78.38 | v90.56,78.38 91.94,78.38 v96.27,74.05 | v107.1,62.64 113.2,62.64 113.99,61.85 121.07,61.85 v125.41,57.52 | v131.9,49.25 v126.59,54.57 | v132.89,14.8 134.07,13.62 134.07,11.06 132.49,9.49 132.49,4.96 J2.34
  Bottom 0.305: v75.8,93.15 72.45,96.5 JP34.2 | v90.56,78.38 v85.64,78.38 | v96.27,74.05 96.27,73.46 v107.1,62.64 | v125.41,57.52 125.41,55.75 v126.59,54.57 | v131.9,49.25 131.9,21.3 132.89,20.31 v132.89,14.8
34_1  (via drill 0.3)
  Top 0.305: v88.99,105.35 89.19,105.35 89.38,105.55 v94.5,105.55 | v99.22,100.82 102.18,100.82 103.36,99.64 105.52,99.64 107.69,97.48 107.69,88.82 110.84,85.67 112.22,85.67 113.2,84.68 113.2,82.52 116.94,78.78 134.26,78.78 136.43,80.94 139.58,80.94 144.89,75.63 144.89,75.23 J1.34
  Bottom 0.305: v88.99,105.35 80.72,105.35 76.59,101.22 76.59,100.43 77.38,99.64 77.38,90.19 75.41,88.23 74.42,88.23 73.83,88.82 73.83,91.18 69.89,95.12 69.89,96.5 JP34.1 | v99.22,100.82 v94.5,105.55
34_2  (via drill 0.3)
  Top 0.305: v55.92,99.45 55.92,104.37 55.13,105.16 55.13,114.6 52.57,117.16 52.57,120.71 52.18,121.1 v50.21,121.1 | v15.17,115.79 v19.11,119.72 | v8.87,113.42 8.08,113.42 v7.69,113.03
  Bottom 0.305: v55.92,99.45 72.06,99.45 74.82,96.69 JP34.3 | v50.21,121.1 33.28,121.1 31.9,119.72 v19.11,119.72 | v15.17,115.79 11.23,115.79 v8.87,113.42 | v7.69,113.03 6.51,114.21 6.51,116.18 4.93,117.75 J5.34
35  (via drill 0.3)
  Top 0.305: v79.93,74.64 79.93,82.52 72.45,90 JP35.2 | v87.02,56.73 94.11,49.64 v106.71,49.64 | v112.02,49.05 116.35,49.05 v121.86,43.54 | v124.82,23.86 131.9,16.77 134.85,16.77 138,13.62 138,6.53 136.43,4.96 J2.35
  Bottom 0.305: v79.93,74.64 87.02,67.56 v87.02,56.73 | v106.71,49.64 107.69,49.64 108.28,49.05 v112.02,49.05 | v121.86,43.54 121.86,39.01 124.82,36.06 v124.82,23.86
35_1  (via drill 0.3)
  Top 0.305: v80.52,98.46 80.72,98.27 80.72,95.51 79.34,94.13 73.83,94.13 69.89,90.19 JP35.1 | v89.58,93.94 94.5,89.01 v94.5,88.82 | v126.78,88.82 127.18,88.82 134.26,81.73 140.96,81.73 143.52,79.17 144.89,79.17 J1.35
  Bottom 0.305: v80.52,98.46 85.05,98.46 v89.58,93.94 | v94.5,88.82 97.65,88.82 98.63,87.83 125.8,87.83 v126.78,88.82
35_2
  Bottom 0.305: JP35.3 75.01,90.19 76.98,92.16 76.98,98.07 74.03,101.02 68.32,101.02 63.59,105.75 14.38,105.75 7.69,112.44 6.31,112.44 4.93,113.82 J5.35
36
  Bottom 0.305: JP36.2 72.26,83.7 70.48,81.93 69.3,81.93 68.71,82.52 68.71,85.08 70.29,86.65 89.38,86.65 92.53,89.8 92.53,152.4 88.79,156.14 11.04,156.14 9.66,157.52 6.9,157.52 5.33,155.94 3.75,155.94 1.19,153.38 1.19,84.09 3.75,81.53 3.75,80.94 1.98,79.17 1.98,24.45 13.4,13.03 J3.1
36_1
  Bottom 0.305: JP36.1 69.89,83.9 72.26,86.26 93.52,86.26 94.3,87.05 126.39,87.05 128.56,89.21 128.56,105.55 136.82,113.82 J4.1
36_2
  Top 0.305: JP36.3 74.82,83.7 74.82,82.32 73.24,80.75 14.58,80.75 13,79.17 J6.1
37  (via drill 0.3)